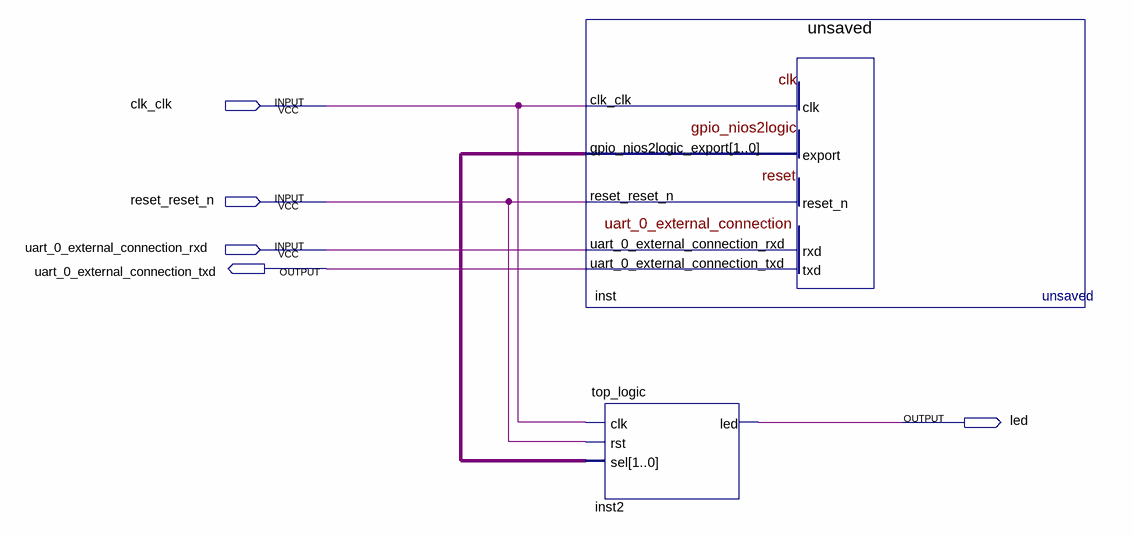
[diagram p0: schematic sheet]
// Quartus schematic uart2usb.bdf as structural Verilog: 2 symbols, 5 pins
module uart2usb (
  input  clk_clk,
  input  reset_reset_n,
  input  uart_0_external_connection_rxd,
  output uart_0_external_connection_txd,
  output led
);

  wire [1:0] inst_gpio_nios2logic_export;

  unsaved inst (
    .clk_clk(clk_clk), .reset_reset_n(reset_reset_n),
    .uart_0_external_connection_rxd(uart_0_external_connection_rxd),
    .gpio_nios2logic_export(inst_gpio_nios2logic_export),
    .uart_0_external_connection_txd(uart_0_external_connection_txd));
  top_logic inst2 (.clk(clk_clk), .rst(reset_reset_n), .sel(inst_gpio_nios2logic_export), .led(led));
endmodule
